# Altium schematic sheet BMS-S09-V01-TemperatureSensors.SchDoc: Temperature Sensors
size A3; DrawnBy: Jonn Dillon; DocumentNumber: 9; SheetNumber: 9; SheetTotal: 10; Version: 01; Project: Battery Managment System 2020; PageSetup: Record=PageOptions|CenterHorizontal=True|CenterVertical=True|PrintScale=0.97|XCorrection=1.00|YCorrection=1.00|PrintKind=0|BorderSize=5000000|LeftOffset=0|BottomOffset=0|Orientation=2|PaperLength=1000|PaperWidth=1000|Scale=100|PaperSource=7|PrintQuality=-4|MediaType=1|DitherType=10|PaperKind=A4|PrintScaleMode=1
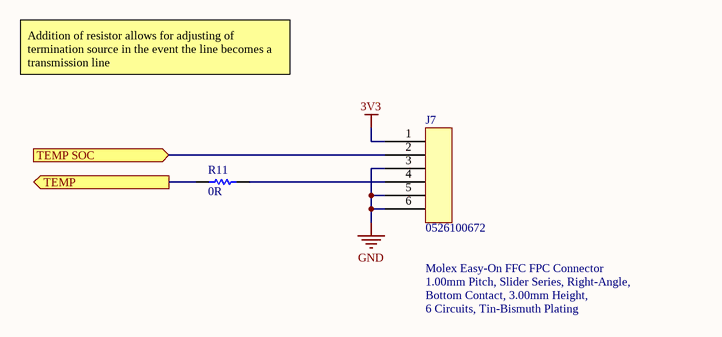
[diagram p0: BMS-S09-V01-TemperatureSensors.SchDoc]

## Parts
J7  0526100672  [526100672]
R11  0R  [Res_ThinFilm_0603]

## Ports
TEMP (out), TEMP SOC (in)

## Nets
3V3: J7.1
GND: J7.3 J7.5 J7.6
TEMP: R11.1 ; port TEMP
TEMP SOC: J7.2 ; port TEMP SOC
NetJ7_4: J7.4 R11.2

## Notes on the sheet
- Addition of resistor allows for adjusting of termination source in the event the line becomes a transmission line
- Molex Easy-On FFC FPC Connector
- 1.00mm Pitch, Slider Series, Right-Angle,
- Bottom Contact, 3.00mm Height,
- 6 Circuits, Tin-Bismuth Plating
- Revision History:
- Sheet Title:
- Rev
- Date
- Description
- Project:
- Size:
- Drawn By:
- A3
- Number:
- Revision:
- Sheet
- Version:
- of
- QUT Motorsport
- O-120, Gardens Point
- 2 George Street
- Brisbane, QLD 4000
- Australia
- Print Date:
- Print Time:
- File Name:

## Library data of the parts
J7 = 6PinMOLEX
R11 = 0R 5% 0603: Resistor, SMD, 0R, 0.1W, 5%, 0603